# EAGLE design picboard (EAGLE 8.4.1)
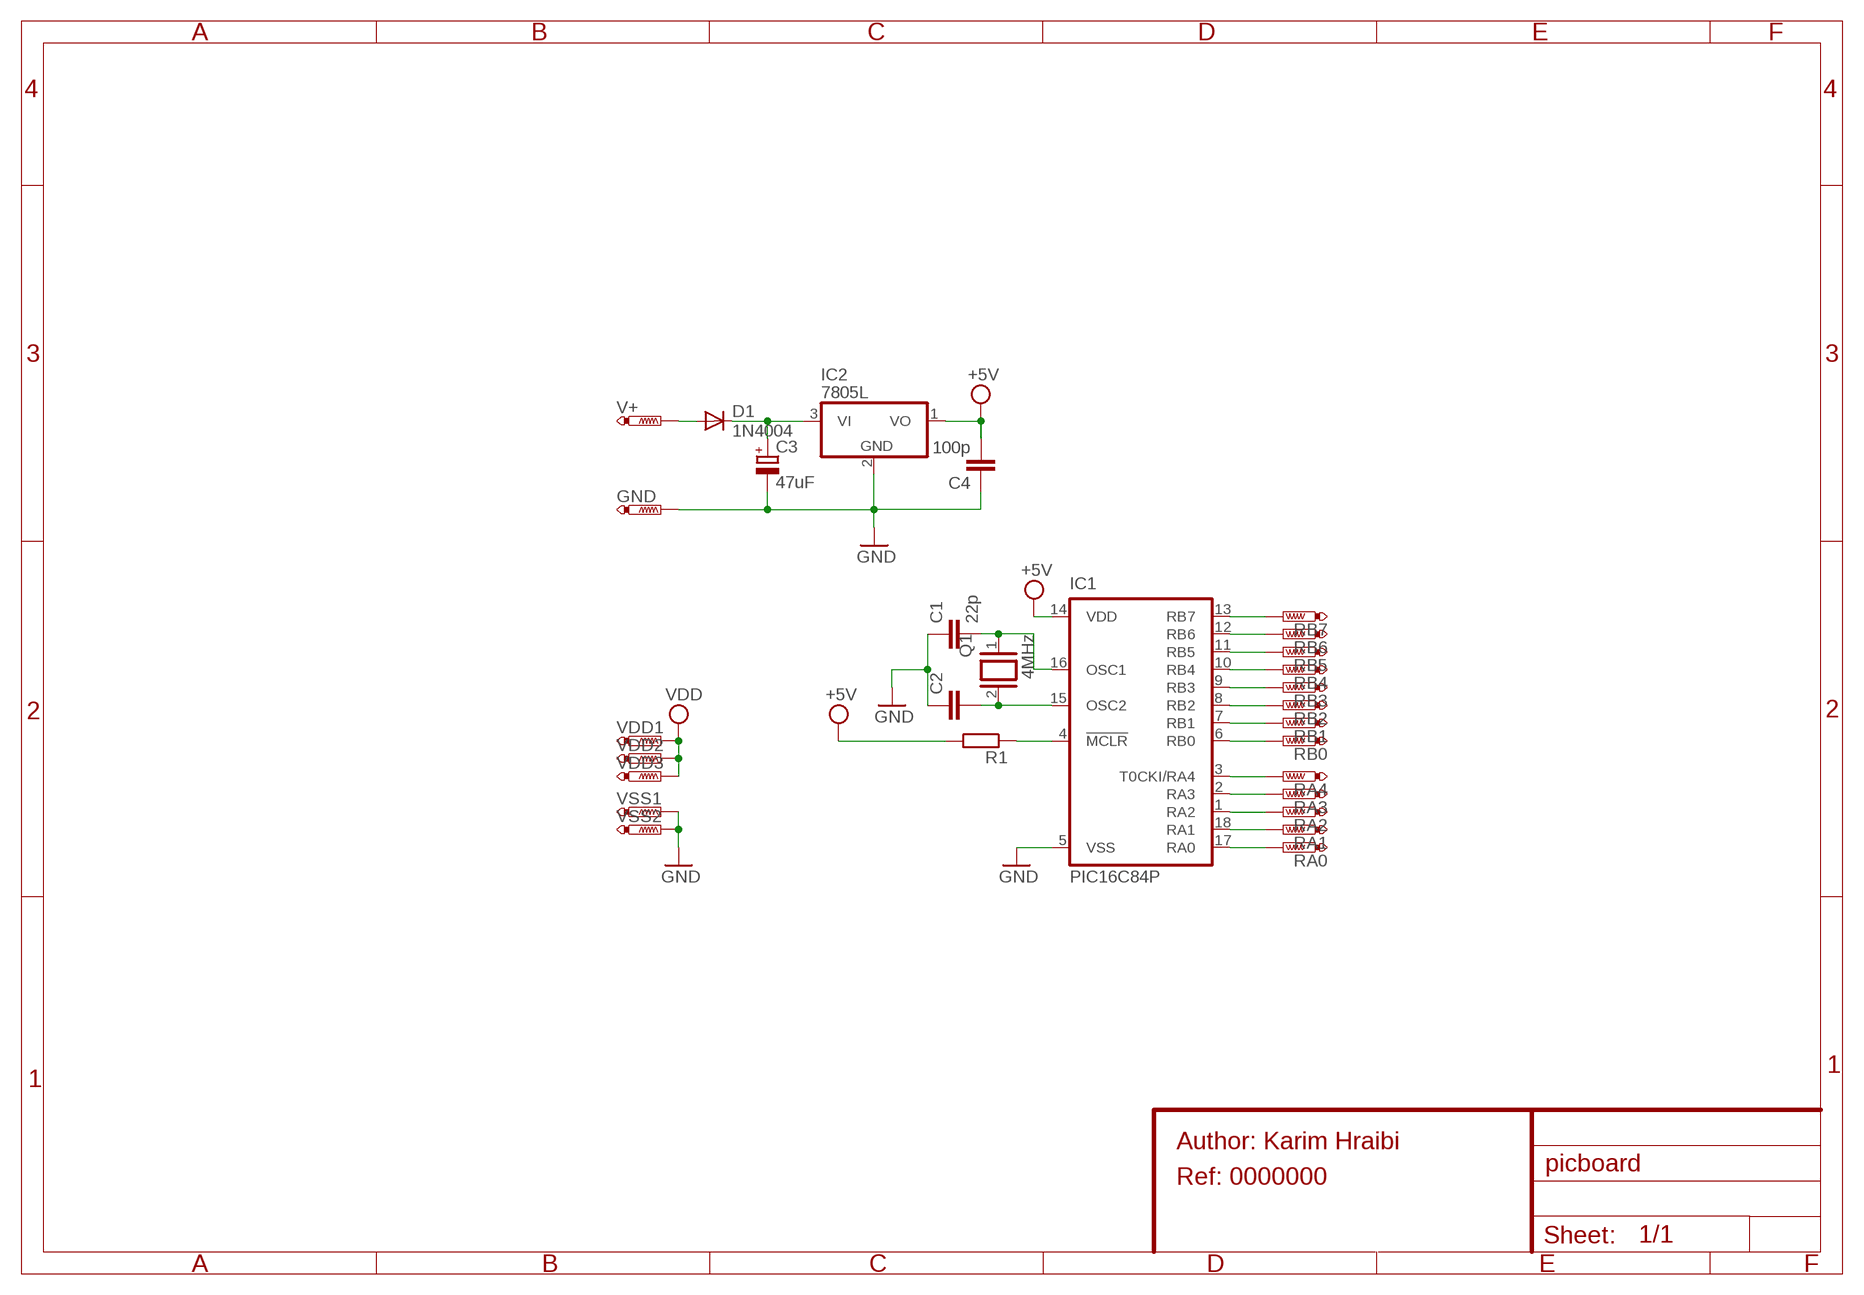
[diagram p0: schematic, sheet 1]

## Parts
C1  22p  C-EU025-025X050  [C025-025X050]
C2  C-EU025-025X050  [C025-025X050]
C3  47uF  CPOL-EUE2.5-5  [E2,5-5]
C4  100p  C-EU025-025X050  [C025-025X050]
D1  1N4004  [DO41-10]
GND  PTR1PAD1  [P1]
IC1  PIC16C84P  [DIL18]
IC2  7805L  [TO92]
Q1  4MHz  XTAL/S  [QS]
R1  R-EU_0207/2V  [0207/2V]
RA0  PTR1PAD1  [P1]
RA1  PTR1PAD1  [P1]
RA2  PTR1PAD1  [P1]
RA3  PTR1PAD1  [P1]
RA4  PTR1PAD1  [P1]
RB0  PTR1PAD1  [P1]
RB1  PTR1PAD1  [P1]
RB2  PTR1PAD1  [P1]
RB3  PTR1PAD1  [P1]
RB4  PTR1PAD1  [P1]
RB5  PTR1PAD1  [P1]
RB6  PTR1PAD1  [P1]
RB7  PTR1PAD1  [P1]
V+  PTR1PAD1  [P1]
VDD1  PTR1PAD1  [P1]
VDD2  PTR1PAD1  [P1]
VDD3  PTR1PAD1  [P1]
VSS1  PTR1PAD1  [P1]
VSS2  PTR1PAD1  [P1]

## Nets
GND: C1.1 C2.1 C3.- C4.1 GND.P$1(TP) IC1.5(VSS) IC2.2(GND) VSS1.P$1(TP) VSS2.P$1(TP)
N$1: C2.2 IC1.15(OSC2) Q1.2
N$2: C1.2 IC1.16(OSC1) Q1.1
N$3: IC1.13(RB7) RB7.P$1(TP)
N$4: IC1.12(RB6) RB6.P$1(TP)
N$5: IC1.11(RB5) RB5.P$1(TP)
N$6: IC1.10(RB4) RB4.P$1(TP)
N$7: IC1.9(RB3) RB3.P$1(TP)
N$8: IC1.8(RB2) RB2.P$1(TP)
N$9: IC1.7(RB1) RB1.P$1(TP)
N$10: IC1.6(RB0) RB0.P$1(TP)
N$11: IC1.3(T0CKI/RA4) RA4.P$1(TP)
N$12: IC1.2(RA3) RA3.P$1(TP)
N$13: IC1.1(RA2) RA2.P$1(TP)
N$14: IC1.18(RA1) RA1.P$1(TP)
N$15: IC1.17(RA0) RA0.P$1(TP)
N$16: IC1.4(!MCLR) R1.1
N$17: D1.A V+.P$1(TP)
N$18: C3.+ D1.C IC2.3(VI)
VDD: C4.2 IC1.14(VDD) IC2.1(VO) R1.2 VDD1.P$1(TP) VDD2.P$1(TP) VDD3.P$1(TP) ; supply symbol labelled +5V

## Notes on the sheet
- Author: Karim Hraibi
- Ref: 0000000

## Library data of the parts
C1 C2 C4 = rcl:C-EU: CAPACITOR, European symbol
C3 = rcl:CPOL-EU: POLARIZED CAPACITOR, European symbol
D1 = diode:1N4004: DIODE general purpose rectifier, 1 A
GND RA0 RA1-RA4 RB0 RB1-RB7 V+ VDD1-VDD3 VSS1 VSS2 = testpad:PTR1: TEST PIN
IC1 = microchip:PIC16C84: MICROCONTROLLER EPROM/ROM-based
IC2 = linear:78*: Positive VOLTAGE REGULATOR
Q1 = special:XTAL/S: CRYSTAL
R1 = rcl:R-EU_: RESISTOR, European symbol

## Board
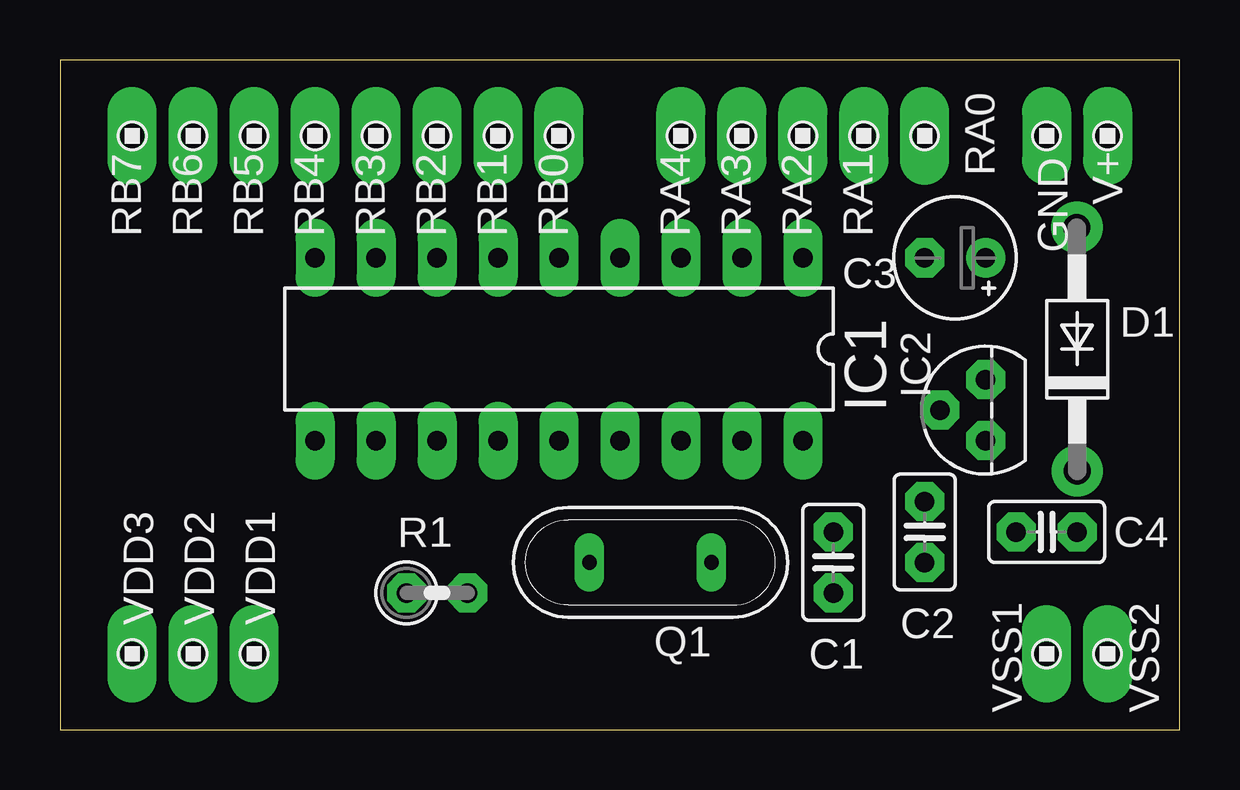
[diagram p1: board, top side]
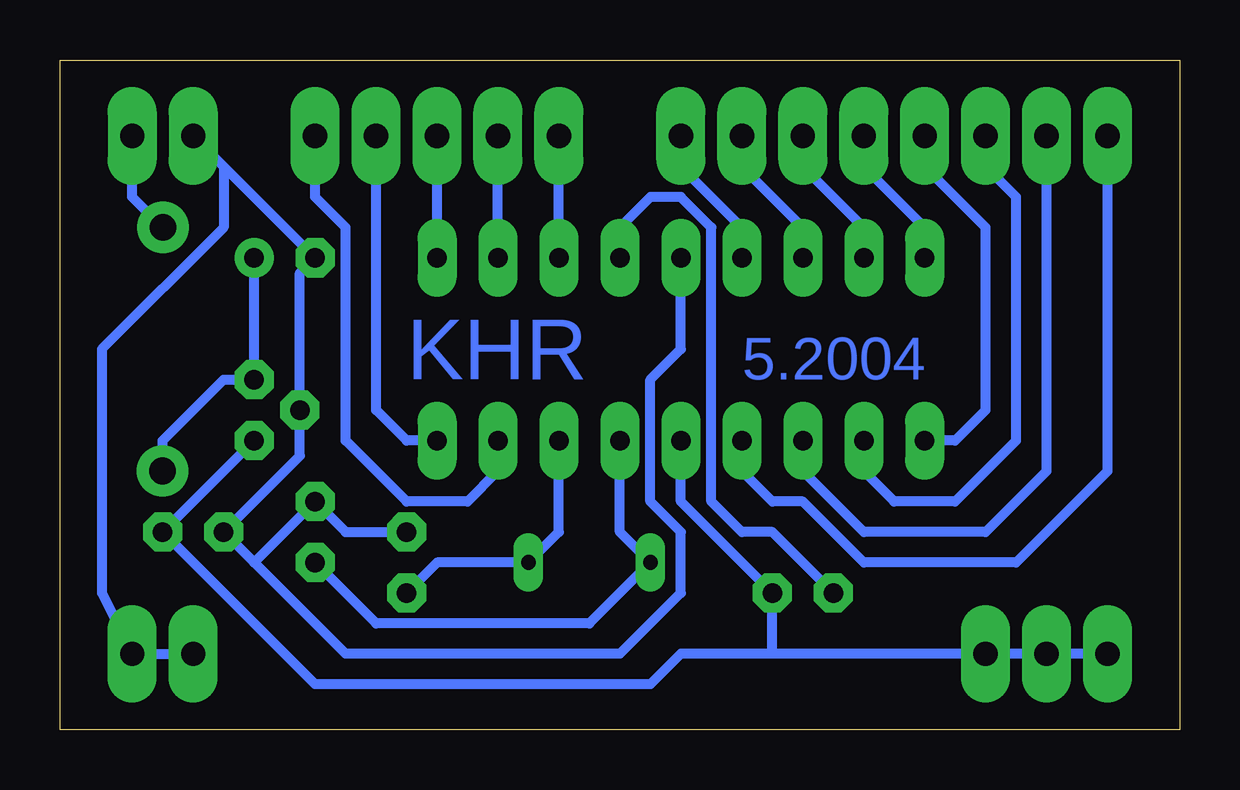
[diagram p2: board, bottom side, seen from below]

Size 46.66 x 27.93 mm. Coordinates in mm from the lower left corner, seen from the top.
Outline: 0,0 46.66,0 46.66,27.93 0,27.93 0,0
Copper layers (1*16): Top 0.035mm / dielectric 1.5mm / Bottom 0.035mm
Design rules "custom": minimum track width 10mil, minimum drill 24mil, track to track 8mil, track to pad 8mil, pad to pad 8mil, via to via 8mil, smd to smd 8mil, copper to edge 40mil, drill to drill 8mil, minimum pad ring 10mil, minimum via ring 8mil, stop-mask expansion 4mil, vias tented up to drill 0mil, thermal gap 10mil

### Footprints (pad centres in the part's own frame; a part is rotated, then mirrored left to right if it is on the bottom)
C025-025X050 = drill 0.813 octagon: 1 -1.27,0; 2 1.27,0
E2,5-5 = drill 0.813 pad 1.6: + -1.27,0 | drill 0.813 pad 1.6 octagon: - 1.27,0
DO41-10 = drill 1.118: A 5.08,0; C -5.08,0
P1 = drill 1.016 long: P$1 0,0
DIL18 = drill 0.813 long: 1 -10.16,-3.81; 2 -7.62,-3.81; 3 -5.08,-3.81; 4 -2.54,-3.81; 5 0,-3.81; 6 2.54,-3.81; 7 5.08,-3.81; 8 7.62,-3.81; 9 10.16,-3.81; 10 10.16,3.81; 11 7.62,3.81; 12 5.08,3.81; 13 2.54,3.81; 14 0,3.81; 15 -2.54,3.81; 16 -5.08,3.81; 17 -7.62,3.81; 18 -10.16,3.81
TO92 = drill 0.813 octagon: 1 -1.27,0; 2 0,1.905; 3 1.27,0
QS = drill 0.61 long: 1 -2.54,0; 2 2.54,0
0207/2V = drill 0.813 octagon: 1 -1.27,0; 2 1.27,0

### Placement (x,y rotation side)
C1  32.22,6.98 270 top
C2  36.03,8.25 270 top
C3  37.3,19.68 180 top
C4  41.11,8.25 0 top
D1  42.38,15.87 90.1 top
GND  41.11,24.76 180 top
IC1  20.79,15.87 180 top
IC2  38.57,13.33 90 top
Q1  24.6,6.98 180 top
R1  15.71,5.71 0 top
RA0  36.03,24.76 0 top
RA1  33.49,24.76 0 top
RA2  30.95,24.76 0 top
RA3  28.41,24.76 0 top
RA4  25.87,24.76 0 top
RB0  20.79,24.76 0 top
RB1  18.25,24.76 0 top
RB2  15.71,24.76 0 top
RB3  13.17,24.76 0 top
RB4  10.63,24.76 0 top
RB5  8.09,24.76 0 top
RB6  5.55,24.76 0 top
RB7  3.01,24.76 0 top
V+  43.65,24.76 180 top
VDD1  8.09,3.17 0 top
VDD2  5.55,3.17 0 top
VDD3  3.01,3.17 0 top
VSS1  41.11,3.17 0 top
VSS2  43.65,3.17 0 top

### Tracks (layer width: path | path; a pad name or v marks a point on that pad's centre or on a via)
GND
  Bottom 0.406: 39.84,23.49 C3.- 36.66,19.04 IC2.2 36.66,11.43 C4.1 38.57,6.98 | 38.57,6.98 C2.1 34.76,8.25 C1.1 | 38.57,6.98 34.76,3.17 23.33,3.17 20.79,5.71 20.79,8.25 22.06,9.52 22.06,14.6 20.79,15.87 IC1.5 | VSS1.P$1 VSS2.P$1 44.92,5.71 44.92,15.87 39.84,20.95 39.84,23.49 | 39.84,23.49 GND.P$1
N$1
  Bottom 0.406: IC1.15 23.33,8.25 Q1.2 24.6,4.44 33.49,4.44 C2.2
N$2
  Bottom 0.406: IC1.16 25.87,8.25 Q1.1 30.95,6.98 C1.2
N$3
  Bottom 0.406: IC1.13 18.25,10.79 16.98,9.52 15.71,9.52 13.17,6.98 6.82,6.98 3.01,10.79 RB7.P$1
N$4
  Bottom 0.406: IC1.12 15.71,10.79 13.17,8.25 8.09,8.25 5.55,10.79 RB6.P$1
N$5
  Bottom 0.406: IC1.11 13.17,10.79 11.9,9.52 9.36,9.52 6.82,12.06 6.82,22.22 8.09,23.49 RB5.P$1
N$6
  Bottom 0.406: RB4.P$1 10.63,23.49 8.09,20.95 8.09,13.33 9.36,12.06 IC1.10
N$7
  Bottom 0.406: IC1.9 10.63,20.95 13.17,23.49 RB3.P$1
N$8
  Bottom 0.406: IC1.8 13.17,20.95 15.71,23.49 RB2.P$1
N$9
  Bottom 0.406: IC1.7 15.71,20.95 18.25,23.49 RB1.P$1
N$10
  Bottom 0.406: IC1.6 18.25,20.95 20.79,23.49 RB0.P$1
N$11
  Bottom 0.406: IC1.3 RA4.P$1
N$12
  Bottom 0.406: IC1.2 RA3.P$1
N$13
  Bottom 0.406: IC1.1 RA2.P$1
N$14
  Bottom 0.406: RA1.P$1 33.49,13.33 32.22,12.06 IC1.18
N$15
  Bottom 0.406: RA0.P$1 36.03,22.22 34.76,20.95 34.76,12.06 32.22,9.52 29.68,9.52 28.41,10.79 IC1.17
N$16
  Bottom 0.406: R1.1 16.98,8.25 18.25,8.25 19.52,9.52 19.52,20.95 20.79,22.22 22.06,22.22 23.33,20.95 IC1.4
N$17
  Bottom 0.406: V+.P$1 43.65,22.22 D1.A
N$18
  Bottom 0.406: C3.+ IC2.3 39.84,14.6 42.38,12.06 D1.C
VDD
  Bottom 0.406: IC2.1 C4.2 36.03,1.9 22.06,1.9 20.79,3.17 16.98,3.17 | IC1.14 20.79,9.52 R1.2 16.98,3.17 | VDD3.P$1 VDD2.P$1 VDD1.P$1 16.98,3.17

### Text on the board
Bottom: 5.2004 | KHR